# EAGLE design PIC32MXBOARD (EAGLE 6.4)
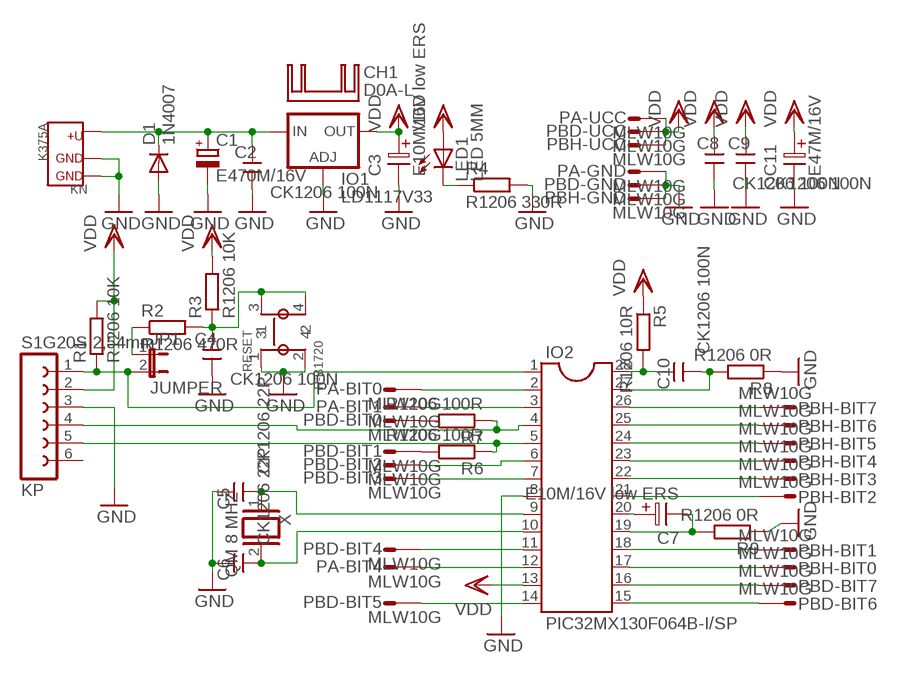
[diagram p0: schematic, sheet 1]

## Parts
C1  E470M/16V  CPOL-EUE5-10.5  [E5-10,5]
C2  CK1206 100N  CK+  [CK+]
C3  E10M/16V low ERS  CEL2,5  [ES-2,5L]
C4  CK1206 100N  CK+  [CK+]
C5  CK1206 22P  CK+  [CK+]
C6  CK1206 22P  CK+  [CK+]
C7  E10M/16V low ERS  CEL2,5  [ES-2,5L]
C8  CK1206 100N  CK+  [CK+]
C9  CK1206 100N  CK+  [CK+]
C10  CK1206 100N  CK+  [CK+]
C11  E47M/16V  CEL2,5  [ES-2,5L]
CH1  D0A-L  [D02A-L]
D1  1N4007  1N4004  [DO41-10]
IO1  LD1117V33  LD117AV33  [TO220L1]
IO2  PIC32MX130F064B-I/SP  DIL28-3  [DIL28-3]
JP1  JUMPER  JP1E  [JP1]
KN  K375A  [K375A]
KP  S1G20S 2,54mm  FE06-1  [FE06]
LED1  LED 5MM  LED5MM  [LED5MM]
PA  MLW10G  PSL10MLW10G  [MLW10G]
PBD  MLW10G  PSL10MLW10G  [MLW10G]
PBH  MLW10G  PSL10MLW10G  [MLW10G]
R1  R1206 10K  R-EU_R1206  [R1206]
R2  R1206 470R  R-EU_R1206  [R1206]
R3  R1206 10K  R-EU_R1206  [R1206]
R4  R1206 330R  R-EU_R1206  [R1206]
R5  R1206 10R  R-EU_R1206  [R1206]
R6  R1206 100R  R-EU_R1206  [R1206]
R7  R1206 100R  R-EU_R1206  [R1206]
R8  R1206 0R  R-EU_R1206  [R1206]
R9  R1206 0R  R-EU_R1206  [R1206]
RESET  P-B1720  [P-B1720]
U$2  RAM  [RAM]
X  QM 8 MHZ  XTAL/S  [QS]

## Nets
5V: C1.+ C2.1 D1.C IO1.3(IN) KN.2
GND: C1.- C2.2 C3.2 C4.2 C5.1 C6.1 C8.2 C9.2 C11.2 D1.A IO1.1(ADJ) IO2.8 KN.1 KN.3 KP.3 PA.10 PBD.10 PBH.10 R4.2 R8.1 R9.1 RESET.1 RESET.2
N$1: IO2.1 JP1.2 KP.1 R1.1
N$2: C4.1 R2.2 R3.1 RESET.3 RESET.4
N$3: IO2.4 KP.4 R7.1
N$4: JP1.1 R2.1
N$5: LED1.K(C) R4.1
N$6: IO2.5 KP.5 R6.1
N$7: C5.2 IO2.9 X.1
N$8: C6.2 IO2.10 X.2
N$9: IO2.2 PA.9
N$10: IO2.3 PA.8
N$11: C10.2 IO2.27 R8.2
N$12: C7.2 IO2.19 R9.2
N$13: IO2.12 PA.5
N$14: PBD.9 R7.2
N$15: PBD.8 R6.2
N$16: IO2.6 PBD.7
N$17: IO2.7 PBD.6
N$18: IO2.11 PBD.5
N$20: IO2.14 PBD.4
N$21: IO2.15 PBD.3
N$22: IO2.16 PBD.2
N$23: IO2.17 PBH.9
N$24: IO2.26 PBH.2
N$25: IO2.25 PBH.3
N$26: IO2.24 PBH.4
N$27: IO2.23 PBH.5
N$28: IO2.22 PBH.6
N$29: IO2.21 PBH.7
N$30: IO2.18 PBH.8
N$31: C7.1 IO2.20
N$32: C10.1 IO2.28 R5.2
VDD: C3.1 C8.1 C9.1 C11.1 IO1.2(OUT) IO2.13 KP.2 LED1.A PA.1 PBD.1 PBH.1 R1.2 R3.2 R5.1
Unconnected: KP.6 PA.2 PA.3 PA.4 PA.6 PA.7

## Library data of the parts
C1 = rcl:CPOL-EU: POLARIZED CAPACITOR, European symbol
C2 C4-C6 C8-C10 = !MOJE:CK+
C3 C7 C11 = !MOJE:CEL2,5
CH1 = heatsink:D0A-L: HEATSINK distributor Schukat
D1 = diode:1N4004: DIODE general purpose rectifier, 1 A
IO1 = v-reg:LD117A?*: Low drop fixed and adjustable positive voltage regulators 1 A Source: http://www.st.com/stonline/products/literature/ds/7194/ld1117axx.pdf
IO2 = ic-package:DIL28: Dual In Line
JP1 = jumper:JP1E: JUMPER
KN = !MOJE:K375A
KP = con-lsta:FE06-1: FEMALE HEADER
LED1 = led:LED: LED OSRAM: - CHIPLED LG R971, LG N971, LY N971, LG Q971, LY Q971, LO R971, LY R971 LH N974, LH R974 LS Q976, LO Q976, LY Q976 LO Q996 - Hyper CHIPLED LW Q18S LB Q993, LB Q99A, LB R99A - SideLED LS A670, LO A670, LY A670, LG A670, LP A670 LB A673, LV A673, LT A673, LW A673 LH A674 LY A675 LS A676, LA A676, LO A676, LY A676, LW A676 LS A679, LY A679, LG A679 - Hyper Micro SIDELED® LS Y876, LA Y876, LO Y876, LY Y876 LT Y87S - SmartLED LW L88C, LW L88S LB L89C, LB L89S, LG L890 LS L89K, LO L89K, LY L89K LS L896, LA L896, LO L896, LY L896 - TOPLED LS T670, LO T670, LY T670, LG T670, LP T670 LSG T670, LSP T670, LSY T670, LOP T670, LYG T670 LG T671, LOG T671, LSG T671 LB T673, LV T673, LT T673, LW T673 LH T674 LS T676, LA T676, LO T676, LY T676, LB T676, LH T676, LSB T676, LW T676 LB T67C, LV T67C, LT T67C, LS T67K, LO T67K, LY T67K, LW E67C LS E67B, LA E67B, LO E67B, LY E67B, LB E67C, LV E67C, LT E67C LW T67C LS T679, LY T679, LG T679 LS T770, LO T770, LY T770, LG T770, LP T770 LB T773, LV T773, LT T773, LW T773 LH T774 LS E675, LA E675, LY E675, LS T675 LS T776, LA T776, LO T776, LY T776, LB T776 LHGB T686 LT T68C, LB T68C - Hyper Mini TOPLED® LB M676 - Mini TOPLED Santana® LG M470 LS M47K, LO M47K, LY M47K Source: http://www.osram.convergy.de LUXEON: - LUMILED® LXK2-PW12-R00, LXK2-PW12-S00, LXK2-PW14-U00, LXK2-PW14-V00 LXK2-PM12-R00, LXK2-PM12-S00, LXK2-PM14-U00 LXK2-PE12-Q00, LXK2-PE12-R00, LXK2-PE12-S00, LXK2-PE14-T00, LXK2-PE14-U00 LXK2-PB12-K00, LXK2-PB12-L00, LXK2-PB12-M00, LXK2-PB14-N00, LXK2-PB14-P00, LXK2-PB14-Q00 LXK2-PR12-L00, LXK2-PR12-M00, LXK2-PR14-Q00, LXK2-PR14-R00 LXK2-PD12-Q00, LXK2-PD12-R00, LXK2-PD12-S00 LXK2-PH12-R00, LXK2-PH12-S00 LXK2-PL12-P00, LXK2-PL12-Q00, LXK2-PL12-R00 Source: www.luxeon.com KINGBRIGHT: KA-3528ASYC Source: www.kingbright.com
PA PBD PBH = !MOJE:PSL10: CONNECTOR
R1-R9 = rcl:R-EU_: RESISTOR, European symbol
RESET = !MOJE:P-B1720
U$2 = !MOJE:RAM
X = !MOJE:XTAL/S: CRYSTAL

## Board
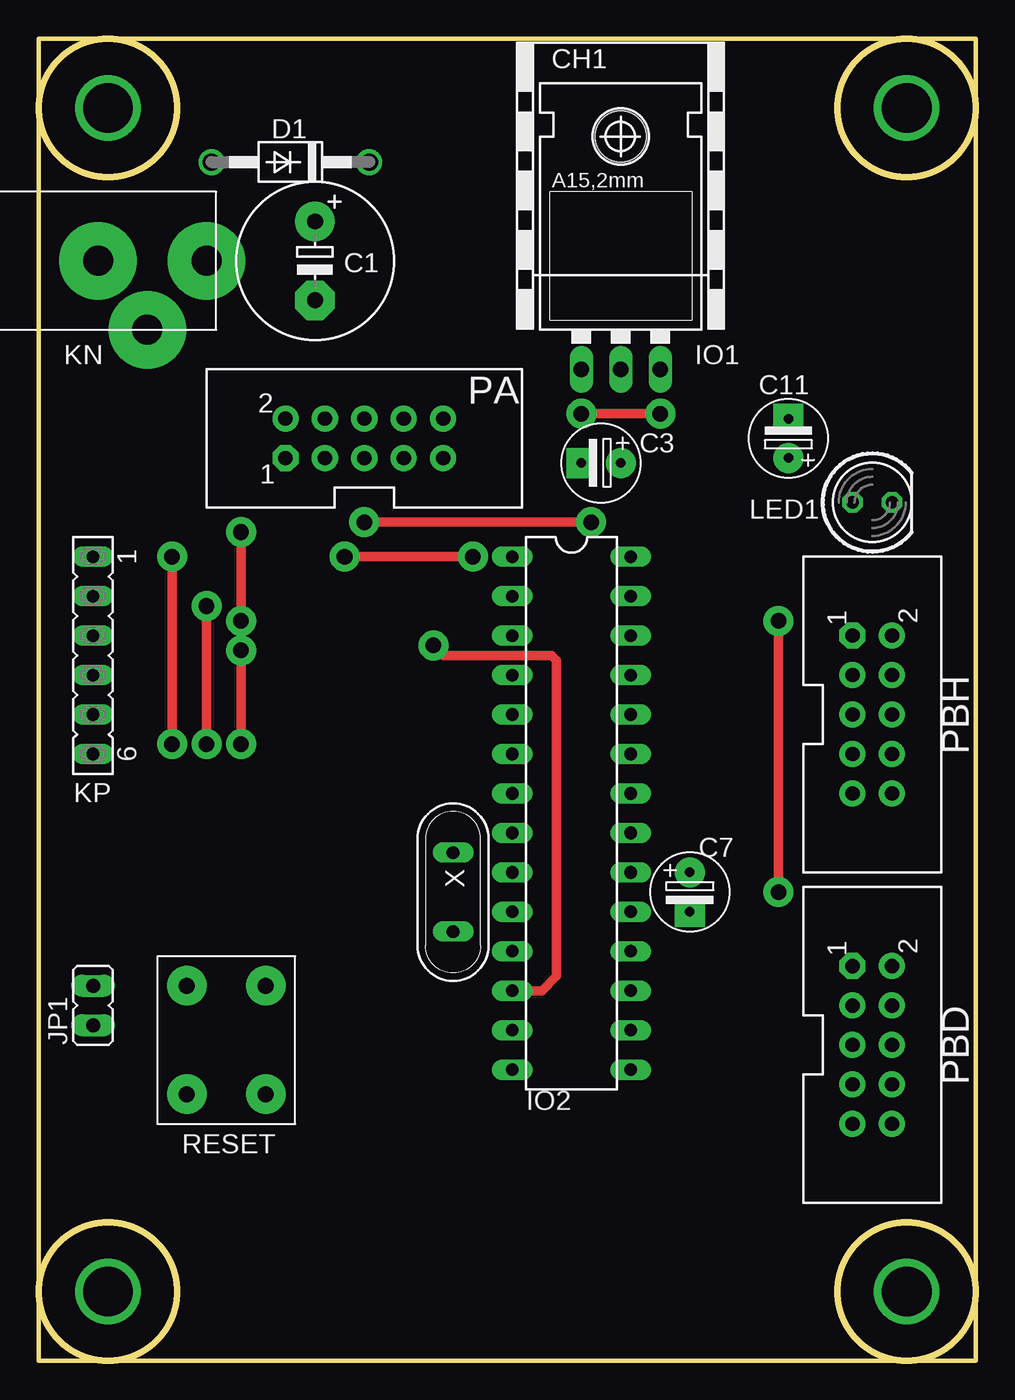
[diagram p1: board, top side]
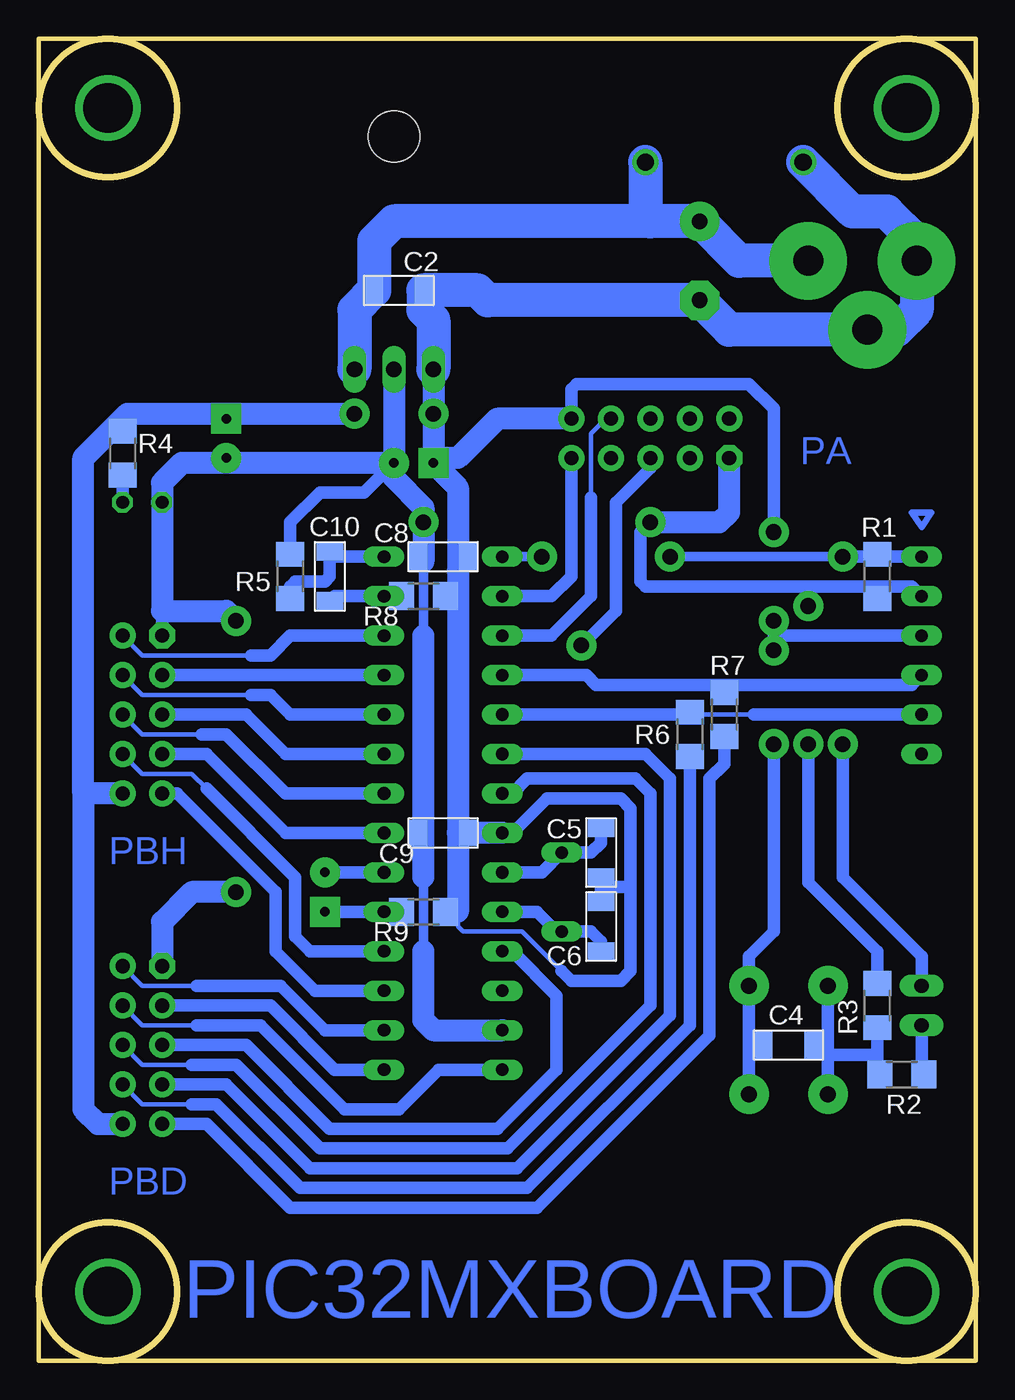
[diagram p2: board, bottom side, seen from below]

Size 60.33 x 85.09 mm. Coordinates in mm from the lower left corner, seen from the top.
Copper layers (1*16): Top 0.035mm / dielectric 1.5mm / Bottom 0.035mm
Design rules "default *": minimum track width 10mil, minimum drill 24mil, track to track 8mil, track to pad 8mil, pad to pad 8mil, via to via 8mil, smd to smd 8mil, copper to edge 40mil, drill to drill 8mil, minimum pad ring 10mil, minimum via ring 8mil, stop-mask expansion 4mil, vias tented up to drill 0mil, thermal gap 10mil

### Footprints (pad centres in the part's own frame; a part is rotated, then mirrored left to right if it is on the bottom)
E5-10,5 = drill 1.016 pad 2.54: + -2.54,0 | drill 1.016 pad 2.54 octagon: - 2.54,0
CK+ = smd 1.14 x 1.7: 1 -1.587,0; 2 1.587,0
ES-2,5L = drill 0.61 pad 1.93: 1 0,0 | drill 0.61 pad 1.93 square: 2 2.54,0
DO41-10 = drill 1.118: A 5.08,0; C -5.08,0
TO220L1 = drill 1.016 long: 1 -2.54,-3.81; 2 0,-3.81; 3 2.54,-3.81 | hole 3.302: 0,11.176
DIL28-3 = drill 0.813 long: 1 -16.51,-3.81; 2 -13.97,-3.81; 3 -11.43,-3.81; 4 -8.89,-3.81; 5 -6.35,-3.81; 6 -3.81,-3.81; 7 -1.27,-3.81; 8 1.27,-3.81; 9 3.81,-3.81; 10 6.35,-3.81; 11 8.89,-3.81; 12 11.43,-3.81; 13 13.97,-3.81; 14 16.51,-3.81; 15 16.51,3.81; 16 13.97,3.81; 17 11.43,3.81; 18 8.89,3.81; 19 6.35,3.81; 20 3.81,3.81; 21 1.27,3.81; 22 -1.27,3.81; 23 -3.81,3.81; 24 -6.35,3.81; 25 -8.89,3.81; 26 -11.43,3.81; 27 -13.97,3.81; 28 -16.51,3.81
JP1 = drill 0.914 long: 1 0,-1.27; 2 0,1.27
K375A = drill 1.93 pad 5: 1 4.445,6.985; 2 4.445,13.97; 3 8.89,10.16
FE06 = drill 0.813 long: 1 -6.35,0; 2 -3.81,0; 3 -1.27,0; 4 1.27,0; 5 3.81,0; 6 6.35,0
LED5MM = drill 0.813 octagon: A -1.27,0; K 1.27,0
MLW10G = drill 0.914 pad 1.676 octagon: 1 -5.08,-1.27 | drill 0.914 pad 1.676: 2 -5.08,1.27; 3 -2.54,-1.27; 4 -2.54,1.27; 5 0,-1.27; 6 0,1.27; 7 2.54,-1.27; 8 2.54,1.27; 9 5.08,-1.27; 10 5.08,1.27
R1206 = smd 1.6 x 1.803: 1 -1.422,0; 2 1.422,0
P-B1720 = drill 1.016 pad 2.54: 1 6.985,0; 2 0,0; 3 6.985,5.08; 4 0,5.08
RAM = drill 3.2: P$1 -37.465,-26.035; P$2 -37.465,25.4; P$3 38.735,25.4; P$4 38.735,-26.035
QS = drill 0.813 long: 1 -2.54,0; 2 2.54,0

### Placement (x,y rotation side)
C1  17.78,70.8 270 top
C2  37.15,68.9 0 bottom
C3  37.47,57.79 180 top
C4  12.06,20.32 180 bottom
C5  24.13,32.7 90 bottom
C6  24.13,27.94 270 bottom
C7  41.91,31.43 270 top
C8  34.29,51.75 0 bottom
C9  34.29,33.97 0 bottom
C10  41.59,50.48 270 bottom
C11  48.26,58.1 90 top
CH1  37.47,73.34 270 top
D1  16.19,77.15 180 top
IO1  37.47,67.63 0 top
IO2  34.29,35.24 270 top
JP1  3.49,22.86 0 top
KN  -3.17,75.25 270 top
KP  3.49,45.4 270 top
LED1  53.66,55.25 0 top
PA  20.95,59.37 0 top
PBD  53.66,20.32 270 top
PBH  53.66,41.59 270 top
R1  6.35,50.48 270 bottom
R2  4.76,18.42 180 bottom
R3  6.35,22.86 90 bottom
R4  54.93,58.42 90 bottom
R5  44.13,50.48 270 bottom
R6  18.41,40.32 270 bottom
R7  16.19,41.59 270 bottom
R8  35.56,49.21 180 bottom
R9  35.56,28.89 180 bottom
RESET  14.61,17.15 90 top
U$2  29.84,41.91 90 top
X  26.67,30.16 270 top

### Tracks (layer width: path | path; a pad name or v marks a point on that pad's centre or on a via)
5V
  Bottom 2.184: KN.2 15.24,70.8 C1.+ 20.95,73.34 | 20.95,73.34 37.47,73.34 38.73,72.07 C2.1 40.01,67.63 IO1.3 | D1.C 21.27,73.66 20.95,73.34
GND  (via drill 1 pad 1.93)
  Top 0.61: v40.01,60.96 v34.92,60.96 | v13.02,45.72 v13.02,39.69 | v13.02,53.34 v13.02,47.63
  Bottom 0.305: 26.67,25.08 29.21,27.62 33.02,27.62 33.34,27.94 33.34,28.89 | 33.34,50.8 33.02,50.8 33.02,51.44 C8.2
  Bottom 0.61: C11.2 49.21,60.64 49.53,60.96 | R8.1 33.66,49.21 33.34,48.9
  Bottom 0.813: 22.23,30.48 22.23,35.56 22.86,36.2 27.62,36.2 29.84,33.97 IO2.8 | 22.23,30.48 22.23,25.08 22.86,24.45 26.04,24.45 26.67,25.08 | 24.13,30.48 C6.1 | C5.1 24.13,30.48 | 24.13,30.48 22.23,30.48 | R4.2 54.93,60.33 55.09,60.48 | KP.3 13.02,46.67 | v13.02,39.69 13.02,27.62 14.61,26.04 RESET.1 14.61,20.64 | RESET.2 14.61,20.64 | C4.2 14.29,20.32 14.61,20.64 | R9.1 33.66,28.89 33.34,29.21 | v13.02,53.34 13.02,61.28 14.61,62.87 25.72,62.87 26.04,62.55 PA.10 | v13.02,47.63 13.02,46.67 | 13.02,46.67 v13.02,45.72
  Bottom 1.422: IO1.1 v34.92,60.96 C3.2 | C3.2 33.34,56.2 33.34,50.8 33.34,48.9 33.34,33.97 | 33.34,33.97 33.34,29.21 33.34,28.89 | 57.47,36.51 57.47,58.1 55.09,60.48 54.61,60.96 49.53,60.96 v40.01,60.96 | PBH.10 57.47,36.51 | 57.47,36.51 57.47,16.19 56.52,15.24 PBD.10 | IO2.8 C9.2 33.34,33.97 | PA.10 30.8,60.64 33.34,58.1 34.61,58.1 C3.2
  Bottom 2.184: IO1.1 34.92,66.99 35.56,67.63 C2.2 32.07,68.9 31.43,68.26 C1.- 15.88,66.36 KN.3 5.08,66.36 3.81,67.63 KN.1 3.81,72.07 5.71,73.98 7.94,73.98 D1.A
N$1  (via drill 1 pad 1.93)
  Top 0.61: v8.57,51.75 v8.57,39.69 | v27.94,51.75 v19.68,51.75
  Bottom 0.61: IO2.1 v27.94,51.75 | v19.68,51.75 v8.57,51.75
  Bottom 0.813: 6.67,51.75 v8.57,51.75 | R1.1 6.67,51.75 | KP.1 6.67,51.75 | v8.57,39.69 8.57,31.12 3.49,26.04 JP1.2
N$2
  Bottom 0.813: RESET.3 9.53,19.69 | 9.53,19.69 RESET.4 | C4.1 10.16,20.32 9.53,19.69 | R3.1 6.35,19.37 | 6.35,19.37 6.35,18.58 R2.2 | 9.53,19.69 6.67,19.69 6.35,19.37
N$3
  Bottom 0.813: KP.4 4.13,43.5 16.51,43.5 | 16.51,43.5 24.45,43.5 25.08,44.13 IO2.4 | R7.1 16.19,43.18 16.51,43.5
N$4
  Bottom 0.813: JP1.1 3.49,18.57 R2.1
N$5
  Bottom 0.813: LED1.K R4.1
N$6
  Bottom 0.305: 18.1,41.59 14.29,41.59
  Bottom 0.813: IO2.5 18.1,41.59 18.26,41.75 R6.1 | 14.29,41.59 KP.5
N$7
  Bottom 0.813: IO2.9 27.94,31.43 X.1 24.77,32.7 24.13,33.34 C5.2
N$8
  Bottom 0.813: IO2.10 28.26,28.89 26.99,27.62 X.2 24.77,27.62 24.13,26.99 C6.2
N$9
  Bottom 0.813: IO2.2 27.3,49.21 26.04,50.48 PA.9
N$10
  Bottom 0.305: PA.8 23.81,60.64 24.77,59.69 24.77,55.56
  Bottom 0.813: IO2.3 27.3,46.67 24.77,49.21 24.77,55.56
N$11
  Bottom 0.813: R8.2 IO2.27 41.27,49.21 C10.2
N$12
  Bottom 0.813: R9.2 IO2.19 C7.2
N$13  (via drill 1 pad 1.93)
  Top 0.61: IO2.12 32.38,23.81 33.34,24.77 33.34,45.09 33.02,45.4 26.04,45.4 v25.4,46.04
  Bottom 0.813: PA.5 20.95,57.47 23.18,55.25 23.18,48.26 v25.4,46.04
N$14
  Bottom 0.813: PBD.9 49.53,15.24 44.13,9.84 28.26,9.84 17.14,20.96 17.14,37.47 16.19,38.42 R7.2
N$15
  Bottom 0.305: 50.48,16.51 53.66,16.51 PBD.8
  Bottom 0.813: R6.2 18.41,21.59 28.89,11.11 43.5,11.11 48.9,16.51 50.48,16.51
N$16
  Bottom 0.813: IO2.6 21.27,39.05 19.68,37.47 19.68,22.23 29.53,12.38 42.86,12.38 48.26,17.78 PBD.7
N$17
  Bottom 0.305: 50.48,19.05 53.66,19.05 PBD.6
  Bottom 0.813: IO2.7 29.84,36.51 28.89,37.47 21.91,37.47 20.95,36.51 20.95,22.86 30.16,13.65 42.23,13.65 47.62,19.05 50.48,19.05
N$18
  Bottom 0.813: PBD.5 46.99,20.32 41.59,14.92 30.8,14.92 26.99,18.73 26.99,23.5 29.84,26.35 IO2.11
N$19
  Bottom 0.406: 3.49,53.66 2.86,54.61 4.13,54.61 3.49,53.66
N$20
  Bottom 0.305: 50.16,21.59 53.66,21.59 PBD.4
  Bottom 0.813: 50.16,21.59 46.04,21.59 40.64,16.19 37.15,16.19 34.61,18.73 IO2.14
N$21
  Bottom 0.813: IO2.15 41.27,18.73 45.4,22.86 PBD.3
N$22
  Bottom 0.305: 50.16,24.13 53.66,24.13 PBD.2
  Bottom 0.813: IO2.16 41.91,21.27 44.77,24.13 50.16,24.13
N$23
  Bottom 0.813: IO2.17 42.55,23.81 45.09,26.35 45.09,30.16 51.44,36.51 PBH.9
N$24
  Bottom 0.305: 46.67,45.4 53.66,45.4 PBH.2
  Bottom 0.813: IO2.26 44.13,46.67 45.4,45.4 46.67,45.4
N$25
  Bottom 0.813: IO2.25 PBH.3
N$26
  Bottom 0.305: 46.67,42.86 53.66,42.86 PBH.4
  Bottom 0.813: IO2.24 44.13,41.59 45.4,42.86 46.67,42.86
N$27
  Bottom 0.813: IO2.23 44.45,39.05 46.99,41.59 PBH.5
N$28
  Bottom 0.305: 49.85,40.32 53.66,40.32 PBH.6
  Bottom 0.813: IO2.22 44.45,36.51 48.26,40.32 49.85,40.32
N$29
  Bottom 0.813: IO2.21 44.45,33.97 49.53,39.05 PBH.7
N$30
  Bottom 0.305: 49.53,36.83 50.48,37.78 53.66,37.78 PBH.8
  Bottom 0.813: IO2.18 42.86,26.35 43.81,27.31 43.81,31.12 49.53,36.83
N$31
  Bottom 0.813: IO2.20 C7.1
N$32
  Bottom 0.813: IO2.28 41.27,51.75 C10.1 41.59,50.48 41.91,50.17 43.81,50.17 44.13,49.85 R5.2
VDD  (via drill 1 pad 1.93)
  Top 0.61: v47.62,47.63 v47.62,30.16 | v10.79,48.58 v10.79,39.69 | v35.56,53.98 v20.95,53.98
  Bottom 0.305: C8.1 35.88,51.12 35.56,51.44 | 35.56,33.97 C9.1
  Bottom 0.61: C11.1 50.16,58.1 50.48,57.79 | 35.56,26.35 35.56,31.12 | 35.56,46.67 35.56,50.8 35.88,51.12
  Bottom 0.813: 52.39,48.26 PBH.1 | C3.1 39.37,55.88 42.23,55.88 44.13,53.98 R5.1 | 6.83,49.21 R1.2 6.35,49.53 6.03,49.85 | v10.79,39.69 10.79,30.8 6.35,26.35 R3.2 | v20.95,53.98 21.59,53.34 21.59,50.17 21.27,49.85 10.79,49.85 | KP.2 4.13,49.85 6.03,49.85 | 6.03,49.85 10.79,49.85 | v10.79,48.58 10.79,49.85
  Bottom 1.422: IO1.2 C3.1 | C3.1 50.48,57.79 51.12,57.79 52.39,56.52 LED1.A 52.39,48.26 48.26,48.26 v47.62,47.63 | v47.62,30.16 50.48,30.16 52.39,28.26 PBD.1 | C3.1 37.47,56.83 35.56,54.93 v35.56,53.98 35.56,51.44 | IO2.13 34.92,21.27 35.56,21.91 35.56,26.35 | 35.56,31.12 35.56,33.97 35.56,46.67 | v20.95,53.98 16.51,53.98 15.88,54.61 PA.1

### Text on the board
Bottom: PA | PBH | PBD | PIC32MXBOARD